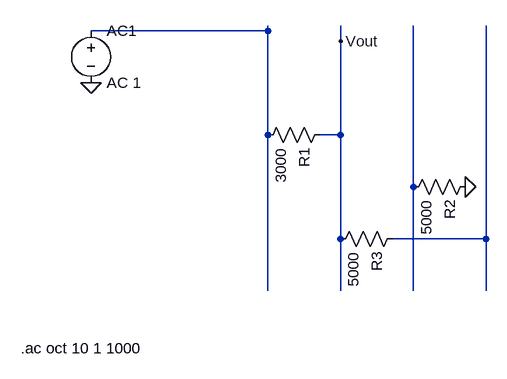
[diagram p0: schematic custom_rl_circuit.asc]
custom_rl_circuit.asc, the LTspice schematic file:
Version 4
SHEET 1 880 680
SYMBOL voltage -272 -176 R0
WINDOW 123 0 0 Left 0
WINDOW 39 0 0 Left 0
SYMATTR InstName AC1
SYMATTR Value AC 1
FLAG -272 -80 0
WIRE 0 -160 -272 -160
TEXT -380 328 Left 2 !.ac oct 10 1 1000
FLAG 112 -144 Vout
WIRE 0 -168 0 240
WIRE 112 -168 112 240
WIRE 224 -168 224 240
WIRE 336 -168 336 240
SYMBOL res 96 -16 R90
SYMATTR InstName R1
SYMATTR Value 3000
SYMBOL res 320 64 R90
SYMATTR InstName R2
SYMATTR Value 5000
SYMBOL res 208 144 R90
SYMATTR InstName R3
SYMATTR Value 5000
WIRE 80 0 112 0
WIRE 192 160 336 160
FLAG 304 80 0

The netlist it stands for:
* custom_rl_circuit.asc
V§AC1 N001 0 AC 1
R1 Vout N001 3000
R2 0 N002 5000
R3 N003 Vout 5000
.ac oct 10 1 1000
.backanno
.end